# Altium schematic sheet ultrasonic_rx.SchDoc: Ultrasonic
size Letter; Author: Kuo, Huang; Revision: 2.0; SheetNumber: 5; SheetTotal: 7
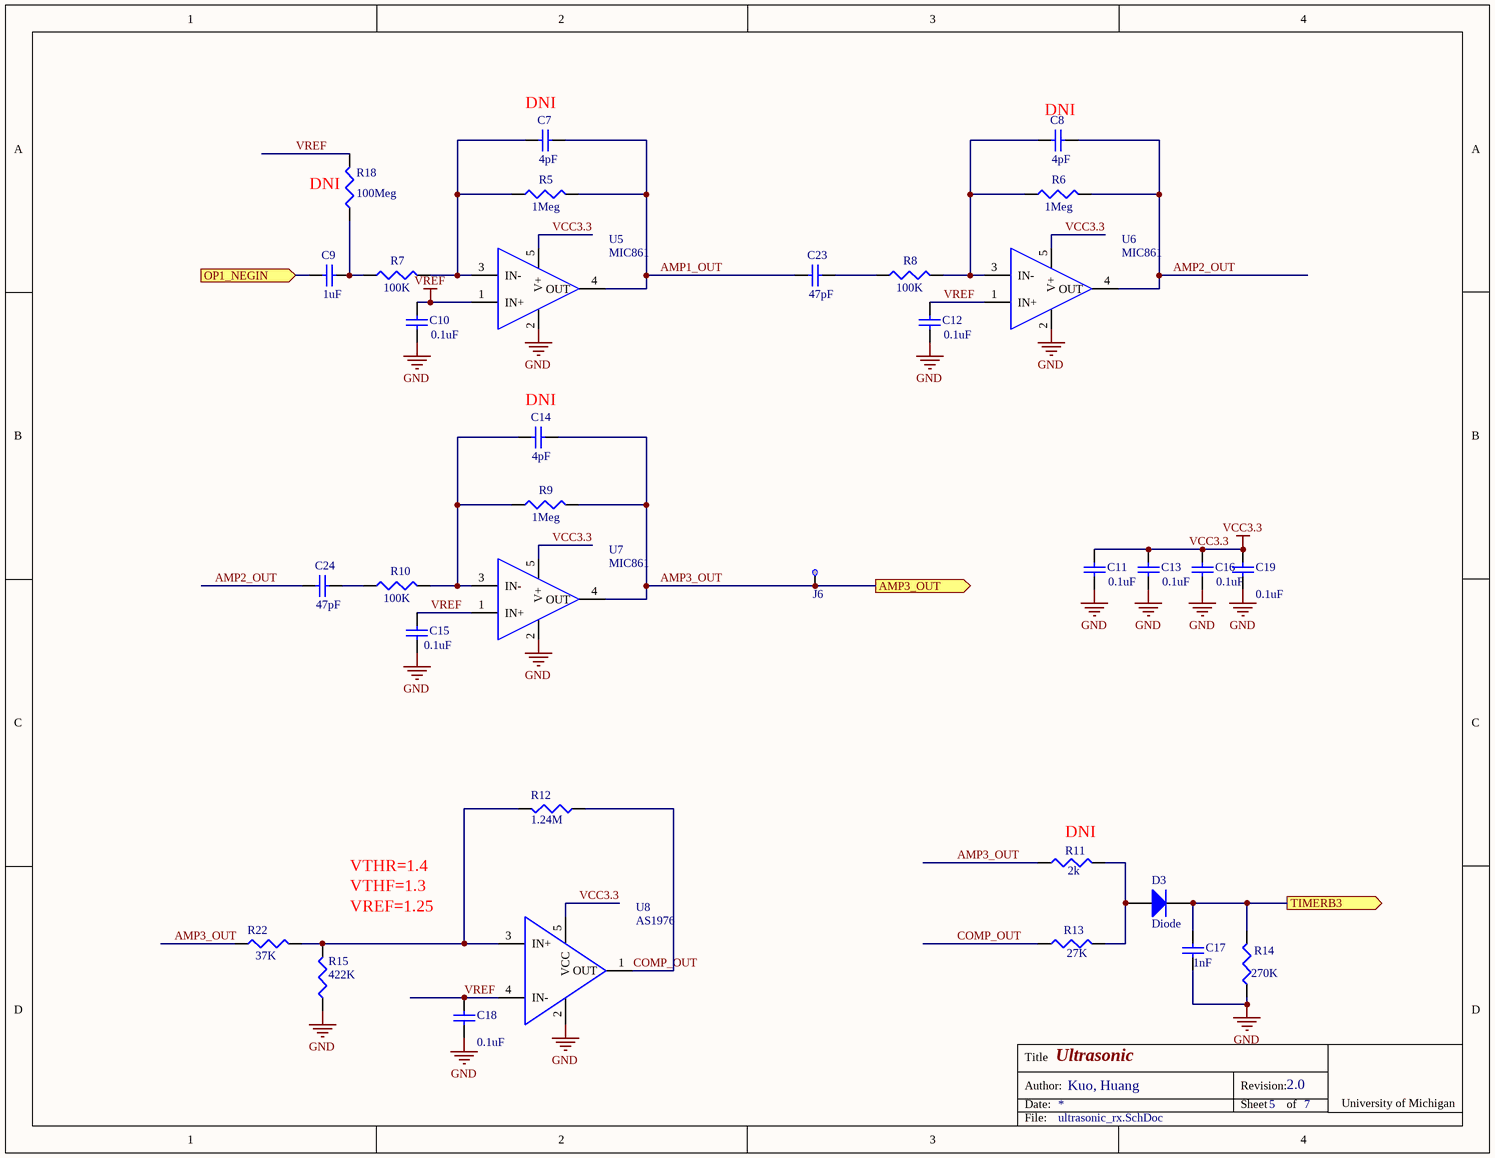
[diagram p0: ultrasonic_rx.SchDoc]

## Parts
C7  value 4pF  [1608[0603]]  (hidden comment: Cap Semi)
C8  value 4pF  [1608[0603]]  (hidden comment: Cap Semi)
C9  value 1uF  [1608[0603]]  (hidden comment: Cap Semi)
C10  value 0.1uF  [1608[0603]]  (hidden comment: Cap Semi)
C11  value 0.1uF  [1608[0603]]  (hidden comment: Cap Semi)
C12  value 0.1uF  [1608[0603]]  (hidden comment: Cap Semi)
C13  value 0.1uF  [1608[0603]]  (hidden comment: Cap Semi)
C14  value 4pF  [1608[0603]]  (hidden comment: Cap Semi)
C15  value 0.1uF  [1608[0603]]  (hidden comment: Cap Semi)
C16  value 0.1uF  [1608[0603]]  (hidden comment: Cap Semi)
C17  value 1nF  [1608[0603]]  (hidden comment: Cap Semi)
C18  value 0.1uF  [1608[0603]]  (hidden comment: Cap Semi)
C19  value 0.1uF  [1608[0603]]  (hidden comment: Cap Semi)
C23  value 47pF  [1608[0603]]  (hidden comment: Cap Semi)
C24  value 47pF  [1608[0603]]  (hidden comment: Cap Semi)
D3  Diode  [J1-0603]
J6  5004  [TestPoint]  (value not drawn)
R5  1Meg  [J1-0603]
R6  1Meg  [J1-0603]
R7  100K  [J1-0603]
R8  100K  [J1-0603]
R9  1Meg  [J1-0603]
R10  100K  [J1-0603]
R11  2k  [J1-0603]
R12  1.24M  [J1-0603]
R13  27K  [J1-0603]
R14  270K  [J1-0603]
R15  422K  [J1-0603]
R18  value 100Meg  [J1-0603]  (hidden comment: Res3)
R22  value 37K  [J1-0603]  (hidden comment: 27K)
U5  MIC861  [SC70-5]
U6  MIC861  [SC70-5]
U7  MIC861  [SC70-5]
U8  AS1976  [SOT23-5]

## Ports
AMP3_OUT (out), OP1_NEGIN (in), TIMERB3 (out)

## Nets
GND: C10.1 C11.1 C12.1 C13.1 C15.1 C16.1 C17.2 C18.1 C19.1 R14.1 R15.1 U5.2(V-) U6.2(V-) U7.2(V-) U8.2(VEE)
VCC3.3: C11.2 C13.2 C16.2 C19.2 U5.5(V+) U6.5(V+) U7.5(V+) U8.5(VCC)
VREF: C10.2 C12.2 C15.2 C18.2 R18.2 U5.1(IN+) U6.1(IN+) U7.1(IN+) U8.4(IN-)
AMP1_OUT: C7.1 C23.1 R5.2 U5.4(OUT)
AMP2_OUT: C8.1 C24.1 R6.2 U6.4(OUT)
AMP3_OUT: C14.1 J6.1(TB) R9.2 R11.1 R22.1 U7.4(OUT) ; port AMP3_OUT
COMP_OUT: R12.1 R13.1 U8.1(OUT)
OP1_NEGIN: C9.2 ; port OP1_NEGIN
TIMERB3: C17.1 D3.2(K) R14.2 ; port TIMERB3
NetC7_2: C7.2 R5.1 R7.2 U5.3(IN-)
NetC8_2: C8.2 R6.1 R8.2 U6.3(IN-)
NetC9_1: C9.1 R7.1 R18.1
NetC14_2: C14.2 R9.1 R10.2 U7.3(IN-)
NetC23_2: C23.2 R8.1
NetC24_2: C24.2 R10.1
NetD3_1: D3.1(A) R11.2 R13.2
NetR12_2: R12.2 R15.2 R22.2 U8.3(IN+)

## Notes on the sheet
- (near C7) DNI
- (near C8) DNI
- (near R18) DNI
- (near C14) DNI
- (near R11) DNI
- VTHR=1.4
- VTHF=1.3
- VREF=1.25
- Title
- Date:
- Author:
- Revision:
- Sheet
- of
- University of Michigan
- File:

## Library data of the parts
C7-C19 C23 C24 = Cap Semi: Capacitor (Semiconductor SIM Model); Published: 8-Jun-2000; LatestRevisionDate: 29-May-2009; LatestRevisionNote: IPC-7351 Footprint Added.; PackageReference: C1206; Publisher: Altium Limited; PackageDescription: Chip Capacitor
D3 = Diode: Default Diode; Published: 8-Jun-2000; LatestRevisionDate: 17-Jul-2002; LatestRevisionNote: Re-released for DXP Platform.; PackageVersion: Sep-1996; PackageReference: SMC; Publisher: Altium Limited; PackageDescription: DO-214-AB/SMC; 2 C-Bend Leads; Body 7.9 x 5.9 mm, inc. leads (LxW); Code_JEDEC: DO-214-AB
J6 = TestPoint: TEST POINT PC MINI .040"D YELLOW; Supplier 1: Digi-Key; Supplier Part Number 1: 5004K-ND; datasheet: http://mail.keyelco.com/ENG._DEPT/PDF%20CAT%20NO%20Drawings/5004.pdf
R5-R15 R18 R22 = Res3: Resistor; Published: 8-Jun-2000; LatestRevisionDate: 29-May-2009; LatestRevisionNote: IPC-7351 Footprint Added.; PackageReference: J1-0603; Publisher: Altium Limited; PackageDescription: Chip Resistor
  R5 R6 R9: Value: 1Meg
  R7 R8 R10: Value: 100K
  R11: Value: 2k
  R12: Value: 1.24M
  R13: Value: 27K
  R14: Value: 270K
  R15: Value: 422K
U5-U7 = MIC861: IC OPAMP 400KHZ 2.7V ULT LP SC70; Supplier 1: Digi-Key; Supplier Part Number 1: 576-2932-1-ND
U8 = AS1976: IC COMPARATOR PUSH/PULL SOT23-5; Supplier 1: Digi-Key; Supplier Part Number 1: AS1976-TCT-ND